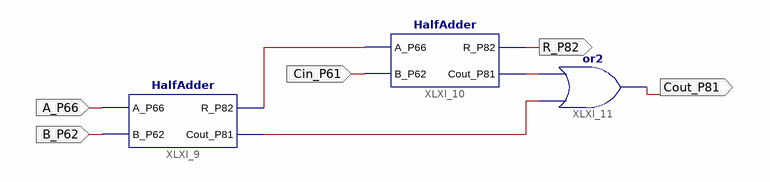
[diagram p0: schematic sheet 1]
// Xilinx ISE schematic FullAdder.sch (spartan6) as structural Verilog: 3 symbols, 5 ports
module FullAdder (
  input  Cin_P61,
  input  A_P66,
  input  B_P62,
  output R_P82,
  output Cout_P81
);

  wire XLXN_6, XLXN_9, XLXN_10;

  HalfAdder XLXI_9 (.A_P66(A_P66), .B_P62(B_P62), .R_P82(XLXN_6), .Cout_P81(XLXN_10));
  HalfAdder XLXI_10 (.A_P66(XLXN_6), .B_P62(Cin_P61), .R_P82(R_P82), .Cout_P81(XLXN_9));
  or XLXI_11 (Cout_P81, XLXN_10, XLXN_9);
endmodule
